# EAGLE design LF-breadboard (EAGLE 9.6.2)
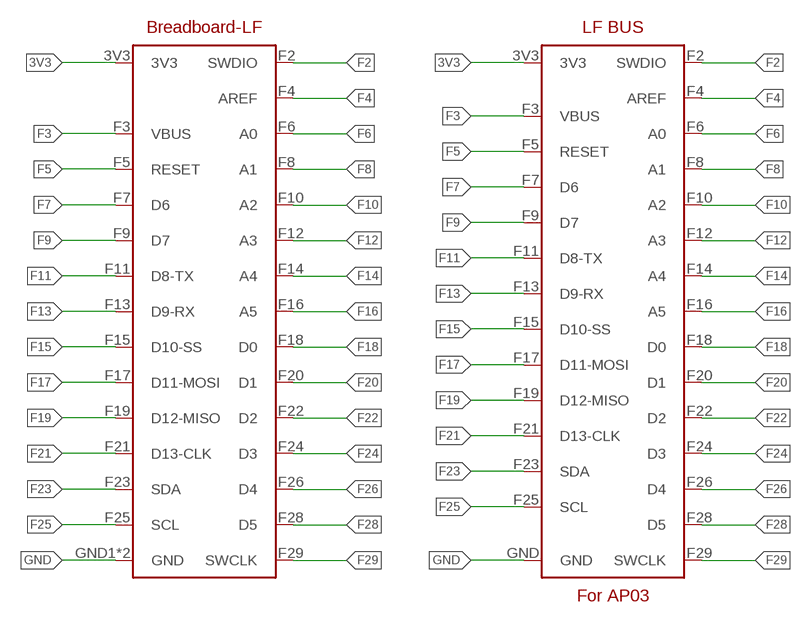
[diagram p0: schematic, sheet 1]

## Parts
U$1  30PAD-BREADBOARD  [30PAD-BREADBOARD]
U$2  29PAD-AP03  [29PAD]

## Nets
3V3: U$1.3V3 U$2.3V3
F2: U$1.F2(F02) U$2.F2(F02)
F3: U$1.F3(F03) U$2.F3(F03)
F4: U$1.F4(F04) U$2.F4(F04)
F5: U$1.F5(F05) U$2.F5(F05)
F6: U$1.F6(F06) U$2.F6(F06)
F7: U$1.F7(F07) U$2.F7(F07)
F8: U$1.F8(F08) U$2.F8(F08)
F9: U$1.F9(F09) U$2.F9(F09)
F10: U$1.F10 U$2.F10
F11: U$1.F11 U$2.F11
F12: U$1.F12 U$2.F12
F13: U$1.F13 U$2.F13
F14: U$1.F14 U$2.F14
F15: U$1.F15 U$2.F15
F16: U$1.F16 U$2.F16
F17: U$1.F17 U$2.F17
F18: U$1.F18 U$2.F18
F19: U$1.F19 U$2.F19
F20: U$1.F20 U$2.F20
F21: U$1.F21 U$2.F21
F22: U$1.F22 U$2.F22
F23: U$1.F23 U$2.F23
F24: U$1.F24 U$2.F24
F25: U$1.F25 U$2.F25
F26: U$1.F26 U$2.F26
F28: U$1.F28 U$2.F28
F29: U$1.F29 U$2.F29
GND: U$1.GND1(GND) U$1.GND2(GND) U$2.GND

## Library data of the parts
U$1 = 29PAD:30PAD-BREADBOARD
U$2 = 29PAD:29PAD-AP03

## Board
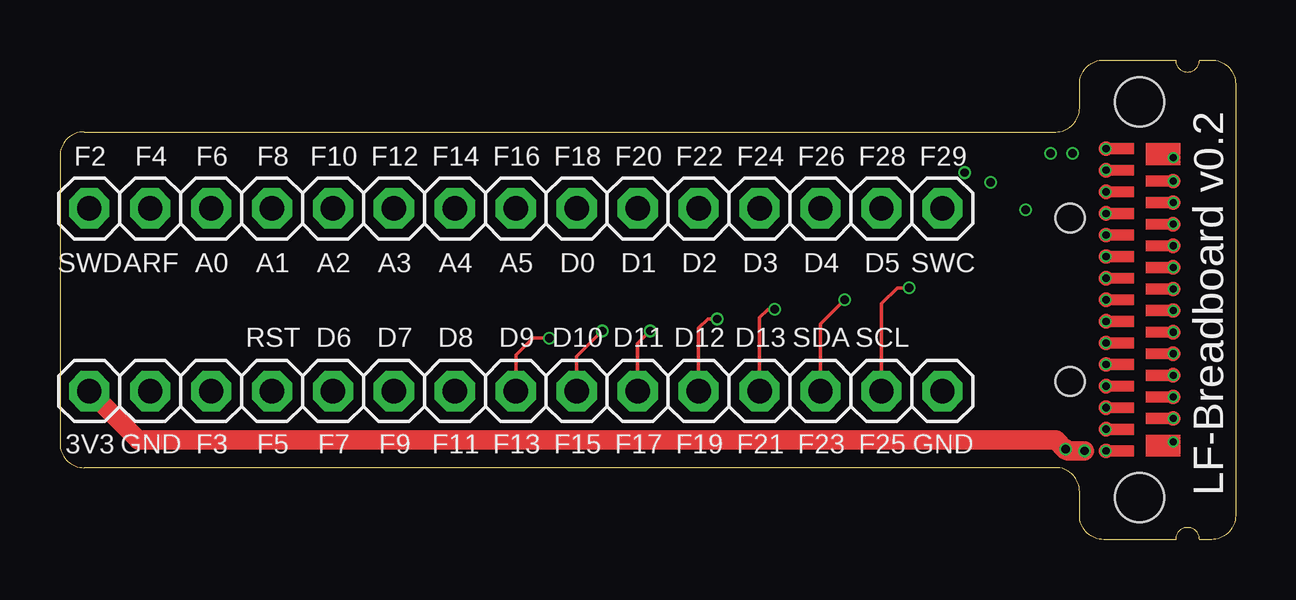
[diagram p1: board, top side]
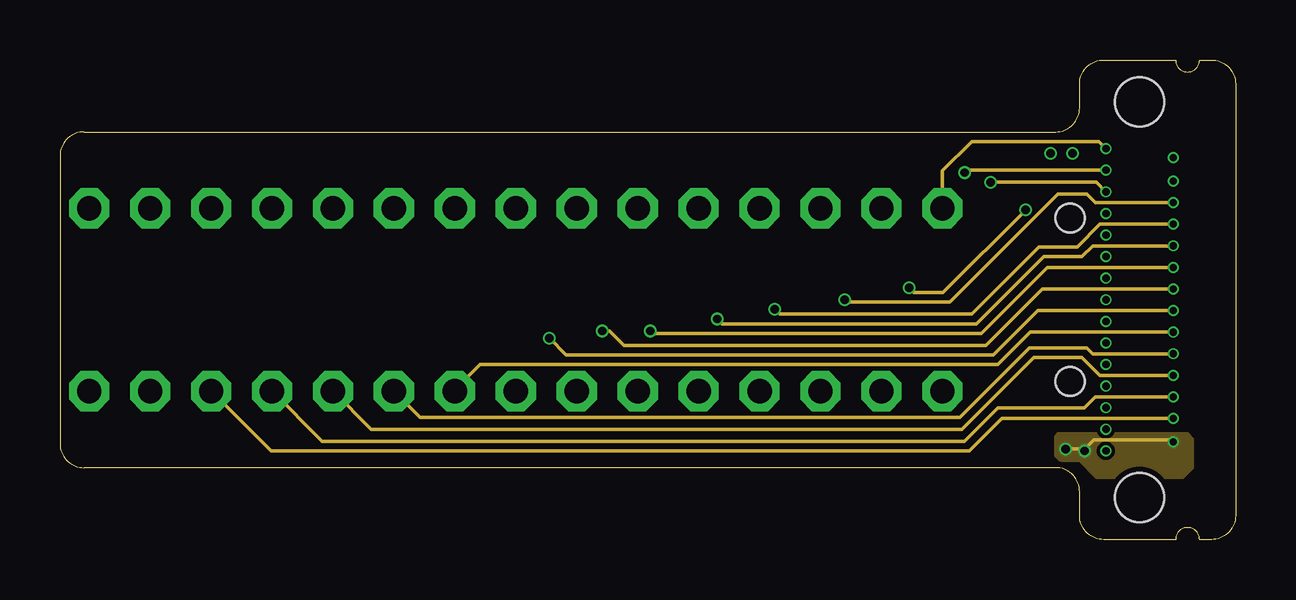
[diagram p2: board, inner layer Route2]
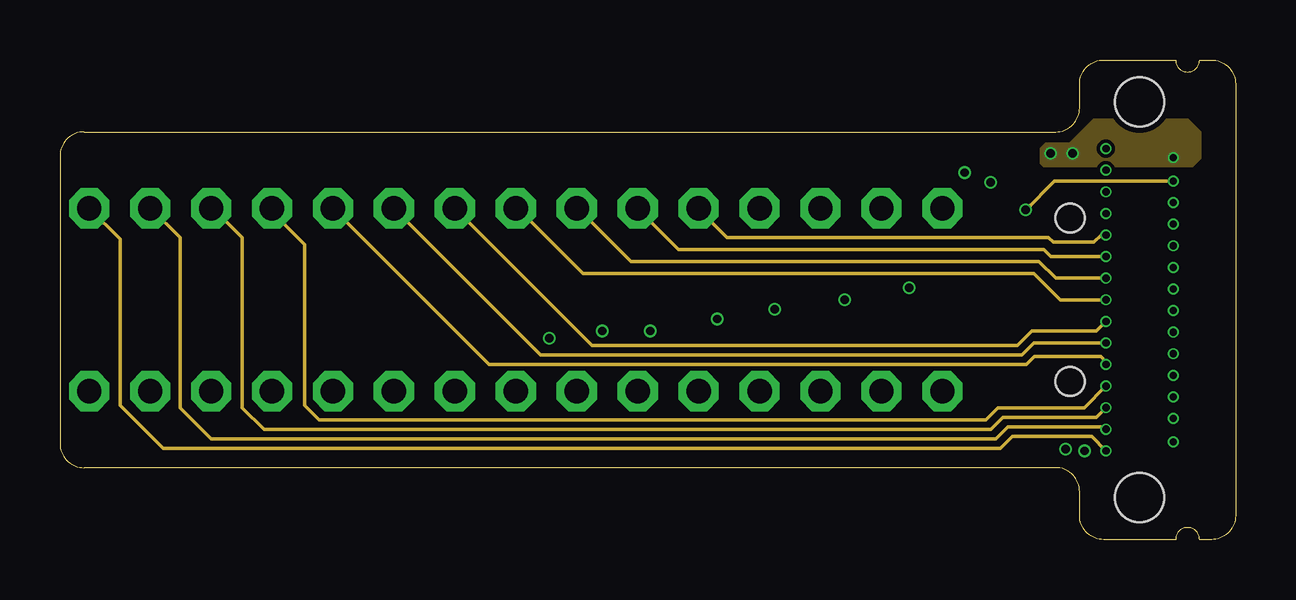
[diagram p3: board, inner layer Route15]
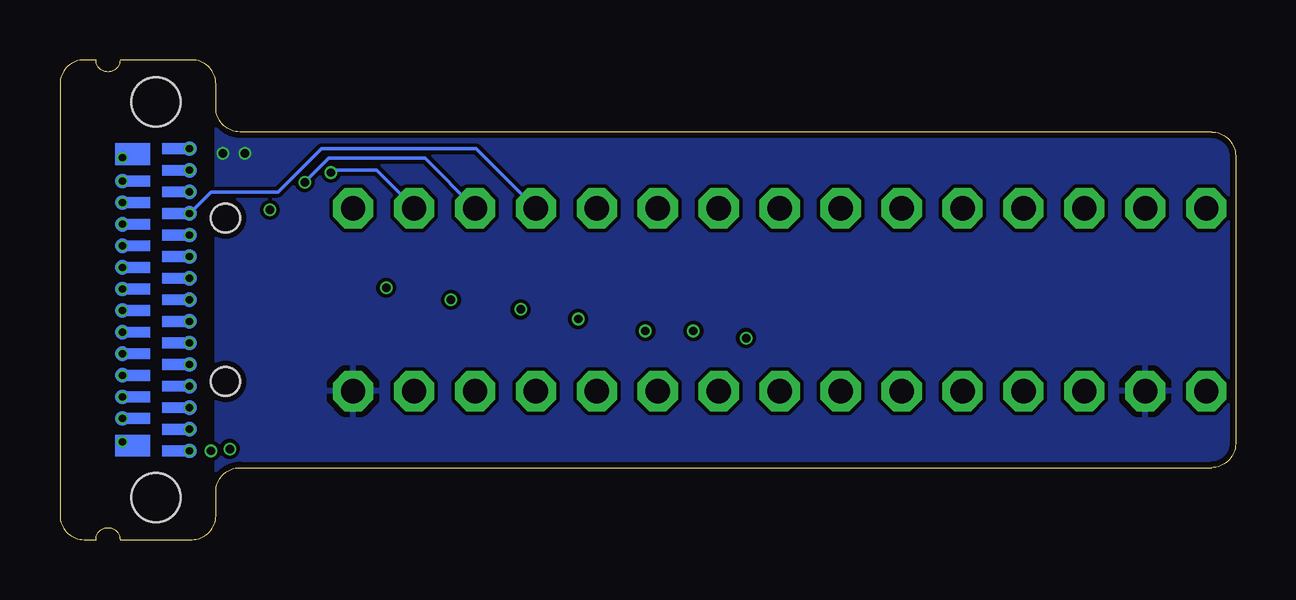
[diagram p4: board, bottom side, seen from below]

Size 49 x 20 mm. Coordinates in mm from the lower left corner, seen from the top.
Outline: 1,17 41.5,17 arc90 42.5,18 42.5,19 arc-90 43.5,20 46.5,20 arc90 47,19.5 arc90 47.5,20 48,20 arc-90 49,19 49,1 arc-90 48,0 47.5,0 arc90 47,0.5 arc90 46.5,0 43.5,0 arc-90 42.5,1 42.5,2 arc90 41.5,3 1,3 arc-90 0,4 0,16 arc-90 1,17
Copper layers (1*2*15*16): Top 0.035mm / dielectric 0.2mm / Route2 0.035mm / dielectric 1.2mm / Route15 0.035mm / dielectric 0.2mm / Bottom 0.035mm
Design rules "Elecrow_4-layer_PCB_eagle_rule *": minimum track width 6mil, minimum drill 12mil, track to track 6mil, track to pad 6mil, pad to pad 6mil, via to via 8mil, smd to smd 0mil, copper to edge 10mil, drill to drill 10mil, minimum pad ring 3mil, minimum via ring 3mil, stop-mask expansion 0mil, vias tented up to drill 100mil, thermal gap 10mil
Holes 1.2 mm at 42.1,13.4 42.1,6.6
tRestrict: area 44.8,3.3 to 45.2,16.7
bRestrict: area 44.8,3.3 to 45.2,16.7

### Footprints (pad centres in the part's own frame; a part is rotated, then mirrored left to right if it is on the bottom)
30PAD-BREADBOARD = drill 1.016 pad 1.676 octagon: 3V3 -17.78,-3.81; F2 -17.78,3.81; F3 -12.7,-3.81; F4 -15.24,3.81; F5 -10.16,-3.81; F6 -12.7,3.81; F7 -7.62,-3.81; F8 -10.16,3.81; F9 -5.08,-3.81; F10 -7.62,3.81; F11 -2.54,-3.81; F12 -5.08,3.81; F13 0,-3.81; F14 -2.54,3.81; F15 2.54,-3.81; F16 0,3.81; F17 5.08,-3.81; F18 2.54,3.81; F19 7.62,-3.81; F20 5.08,3.81; F21 10.16,-3.81; F22 7.62,3.81; F23 12.7,-3.81; F24 10.16,3.81; F25 15.24,-3.81; F26 12.7,3.81; F28 15.24,3.81; F29 17.78,3.81; GND1 -15.24,-3.81; GND2 17.78,-3.81
29PAD = drill 0.3 pad 0.356: 3V3 -5.925,-1.4; F2 -6.3,1.4; F3 -4.95,-1.4; F4 -5.4,1.4; F5 -4.05,-1.4; F6 -4.5,1.4; F7 -3.15,-1.4; F8 -3.6,1.4; F9 -2.25,-1.4; F10 -2.7,1.4; F11 -1.35,-1.4; F12 -1.8,1.4; F13 -0.45,-1.4; F14 -0.9,1.4; F15 0.45,-1.4; F16 0,1.4; F17 1.35,-1.4; F18 0.9,1.4; F19 2.25,-1.4; F20 1.8,1.4; F21 3.15,-1.4; F22 2.7,1.4; F23 4.05,-1.4; F24 3.6,1.4; F25 4.95,-1.4; F26 4.5,1.4; F28 5.4,1.4; F29 6.3,1.4; GND 5.925,-1.4 | hole 2.05: -8.25,0; 8.25,0

### Placement (x,y rotation side)
U$1  19,10 0 top
U$2  45,10 90 top

### Tracks (layer width: path | path; a pad name or v marks a point on that pad's centre or on a via)
3V3  (via drill 0.35)
  Top 0.152: 41.45,4.15 41.5,4.15 | 41.9,3.75 v41.92,3.77
  Top 0.406: U$2.3V3 46.5,3.98
  Top 0.813: 41.45,4.15 3.26,4.15 U$1.3V3 | 41.9,3.75 41.5,4.15 | v41.92,3.77 42,3.7 v42.7,3.7
  Route2 0.152: U$2.3V3 46.33,4.15 43.1,4.15 42.73,3.77 v41.92,3.77
  pour Route2: 41.5,4.1 41.5,3.5 41.7,3.3 42.5,3.3 43.2,2.6 46.8,2.6 47.2,3 47.2,4.2 47,4.4 41.6,4.4 41.5,4.3
F2
  Route15 0.152: 1.29,13.81 U$1.F2 2.5,12.53 2.5,5.6 4.3,3.8 39.2,3.8 39.7,4.3 43,4.3 U$2.F2
F3
  Route2 0.152: U$2.F3 39.25,5.05 37.9,3.7 8.8,3.7 U$1.F3
F4
  Route15 0.152: U$1.F4 3.79,13.81 5,12.6 5,5.5 6.3,4.2 39,4.2 39.5,4.7 43.5,4.7 U$2.F4
F5
  Route2 0.152: U$2.F5 43.15,5.95 42.7,5.5 39.1,5.5 37.7,4.1 10.93,4.1 U$1.F5
F6
  Route15 0.152: U$1.F6 6.39,13.81 7.6,12.6 7.6,5.5 8.5,4.6 38.8,4.6 39.3,5.1 43.2,5.1 U$2.F6
F7
  Route2 0.152: U$2.F7 43.35,6.85 42.6,7.6 40.6,7.6 37.6,4.6 12.97,4.6 U$1.F7
F8
  Route15 0.152: U$1.F8 8.84,13.66 10.2,12.3 10.2,5.6 10.8,5 38.6,5 39.1,5.5 42.7,5.5 U$2.F8
F9
  Route2 0.152: U$2.F9 43.05,7.75 42.8,8 40.4,8 37.5,5.1 15,5.1 U$1.F9
F10
  Route15 0.152: U$2.F10 43.6,7.42 43.38,7.63 40.62,7.63 40.28,7.3 17.89,7.3 U$1.F10
F11
  Route2 0.152: U$2.F11 40.45,8.65 39.1,7.3 17.5,7.3 16.46,6.26 U$1.F11
F12
  Route15 0.152: U$1.F12 20.03,7.7 40.1,7.7 40.6,8.2 U$2.F12
F13  (via drill 0.35)
  Top 0.152: U$1.F13 19,7.69 19.71,8.4 v20.4,8.4
  Route2 0.152: U$2.F13 40.75,9.55 38.9,7.7 21.1,7.7 v20.4,8.4
F14
  Route15 0.152: U$2.F14 43.2,8.7 40.5,8.7 39.9,8.1 22.17,8.1 U$1.F14
F15  (via drill 0.35)
  Top 0.152: v22.6,8.7 21.54,7.64 U$1.F15
  Route2 0.152: U$2.F15 40.95,10.45 38.6,8.1 23.5,8.1 22.9,8.7 v22.6,8.7
F16
  Route15 0.152: U$1.F16 19.09,13.81 21.8,11.1 40.6,11.1 41.7,10 U$2.F16
F17  (via drill 0.35)
  Top 0.152: U$1.F17 24.08,8.18 v24.6,8.7
  Route2 0.152: U$2.F17 41.15,11.35 38.4,8.6 24.7,8.6 v24.6,8.7
F18
  Route15 0.152: U$1.F18 21.59,13.81 23.8,11.6 40.8,11.6 41.5,10.9 U$2.F18
F19  (via drill 0.35)
  Top 0.152: v27.4,9.2 27,9.2 26.62,8.82 U$1.F19
  Route2 0.152: U$2.F19 43.05,12.25 42.6,11.8 41,11.8 38.2,9 27.6,9 v27.4,9.2
F20
  Route15 0.152: U$1.F20 25.79,12.1 41,12.1 41.3,11.8 U$2.F20
F21  (via drill 0.35)
  Top 0.152: v29.8,9.6 29.5,9.6 29.16,9.26 U$1.F21
  Route2 0.152: U$2.F21 43.35,13.15 42.4,12.2 40.8,12.2 38,9.4 30,9.4 v29.8,9.6
F22
  Route15 0.152: U$1.F22 26.62,13.78 27.8,12.6 41.2,12.6 41.4,12.4 43.1,12.4 43.4,12.7 U$2.F22
F23  (via drill 0.35)
  Top 0.152: v32.7,10 31.7,9 U$1.F23
  Route2 0.152: U$2.F23 43.15,14.05 42.8,14.4 41.6,14.4 37.1,9.9 32.8,9.9 v32.7,10
F24
  Route15 0.152: 29.16,13.64 U$1.F24
  Bottom 0.152: U$1.F24 31.65,16.3 38.1,16.3 39.9,14.5 42.7,14.5 U$2.F24
F25  (via drill 0.35)
  Top 0.152: v35.4,10.5 34.9,10.5 34.24,9.84 U$1.F25
  Route2 0.152: v40.25,13.75 36.8,10.3 35.6,10.3 v35.4,10.5
  Route15 0.152: U$2.F25 41.45,14.95 v40.25,13.75
F26  (via drill 0.35)
  Route2 0.152: v38.8,14.9 43.2,14.9 U$2.F26
  Bottom 0.152: v38.8,14.9 37.8,15.9 33.79,15.9 U$1.F26
F28  (via drill 0.35)
  Route2 0.152: U$2.F28 37.7,15.4 v37.7,15.3
  Bottom 0.152: v37.7,15.3 37.6,15.4 35.8,15.4 34.24,13.84 U$1.F28
F29
  Route2 0.152: U$1.F29 36.78,15.38 38,16.6 43.3,16.6 U$2.F29
GND  (via drill 0.35)
  other vias: 41.3,16.1 42.2,16.1
  pour Route15: 47.2,15.6 47.5,15.9 47.5,17 47,17.5 43.1,17.5 42.1,16.5 41.1,16.5 40.9,16.3 40.9,15.7 41,15.6
  pour Bottom: 0,0 0,20 42.5,20 42.5,0

### Text on the board
tPlace: F2 | F4 | F6 | F8 | F10 | F12 | F14 | F16 | F18 | F20 | F22 | F24 | F26 | F28 | F29 | SWD | ARF | A0 | A1 | A2 | A3 | A4 | A5 | D0 | D1 | D2 | D3 | D4 | D5 | SWC | LF-Breadboard v0.2 | RST | D6 | D7 | D8 | D9 | D10 | D11 | D12 | D13 | SDA | SCL | 3V3 | GND | F3 | F5 | F7 | F9 | F11 | F13 | F15 | F17 | F19 | F21 | F23 | F25 | GND